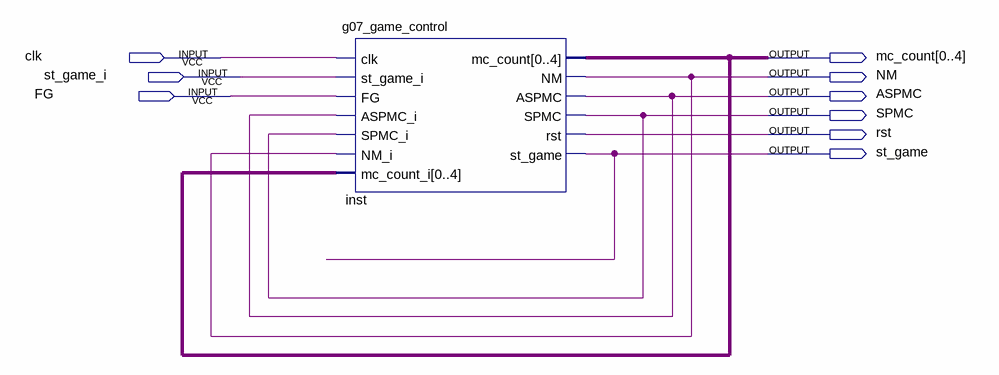
[diagram p0: schematic sheet]
// Quartus schematic g07_game_control2.bdf as structural Verilog: 1 symbols, 9 pins
module g07_game_control2 (
  input  clk,
  input  st_game_i,
  input  FG,
  output [0:4] mc_count,
  output NM,
  output ASPMC,
  output SPMC,
  output rst,
  output st_game
);

  g07_game_control inst (
    .clk(clk), .st_game_i(st_game_i), .FG(FG), .ASPMC_i(ASPMC), .SPMC_i(SPMC), .NM_i(NM),
    .mc_count_i(mc_count), .mc_count(mc_count), .NM(NM), .ASPMC(ASPMC), .SPMC(SPMC), .rst(rst),
    .st_game(st_game));
endmodule
